# Altium schematic sheet Mainboard_ThermistorAmp.SchDoc
size A
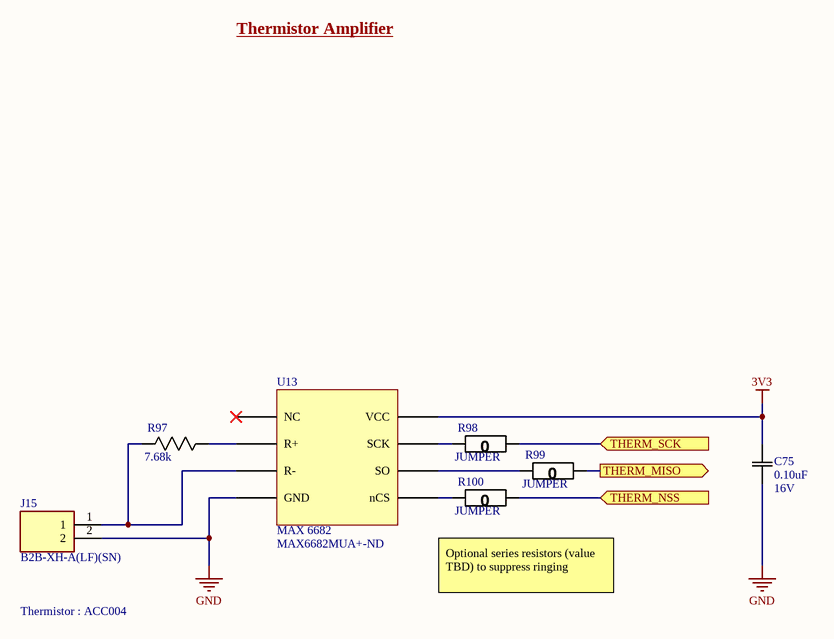
[diagram p0: Mainboard_ThermistorAmp.SchDoc]

## Parts
C75  Rating: 16V  [0805]  (hidden comment: 0.10uF)
J15  B2B-XH-A(LF)(SN)  [JST_B2B-XH-A(LF)(SN)]
R97  7.68k  [0805]
R98  JUMPER  [0805]
R99  JUMPER  [0805]
R100  JUMPER  [0805]
U13  MAX 6682  Supplier Part Number 1: MAX6682MUA+-ND  [8-MSOP]

## Ports
THERM_MISO (out), THERM_NSS (in), THERM_SCK (in)

## Nets
3V3: C75.1(C1) U13.8(VCC)
GND: C75.2(C2) J15.2 U13.4(GND)
THERM_MISO: R99.1(R1) ; port THERM_MISO
THERM_NSS: R100.1(R1) ; port THERM_NSS
THERM_SCK: R98.1(R1) ; port THERM_SCK
NetJ15_1: J15.1 R97.2(R2) U13.3(R-)
NetR97_1: R97.1(R1) U13.2(R+)
NetR98_2: R98.2(R2) U13.7(SCK)
NetR99_2: R99.2(R2) U13.6(SO)
NetR100_2: R100.2(R2) U13.5(nCS)

Not connected (* = marked no-connect by the designer): U13 1(NC)*

## Notes on the sheet
- Thermistor Amplifier
- Optional series resistors (value TBD) to suppress ringing
- Thermistor : ACC004

## Library data of the parts
C75 = CAP 0.10uF 16V: CAP CER 0.10UF 16V X5R 0603/0805; Tolerance: 10%; Package: 0603/0805; Temperature Coefficient: X5R; Operating Temperature: -55°C ~ 85°C; Value: 0.10uF
J15 = B2B-XH-A(LF)(SN): Connector Header Through Hole 2 position 0.098 _2.50mm_ / JST XH; MP: B2B-XH-A_LF__SN_; MF: JST Sales; Price: None; Package: None; Value: *; Availability: Unavailable; SnapEDA_Link: https://www.snapeda.com/parts/B2B-XH-A%28LF%29%28SN%29/JST%20Sales%20America%20Inc./view-part/492310/?ref=snap
R97 = RES 7.68k 0.15W: RES SMD 7.68K OHM 0.1% 0.15W 0805; Power (Watts): 0.125W; Tolerance: 5%; Package: 0805; Value: 7.68k
R98-R100 = RES 0 JUMPER: RES SMD 0 OHM JUMPER GENERIC 0805; Value: 0; Package: 0805
U13 = MAX 6682: MAX 6685 Thermistor - SPI converter, 8bit; Supplier 1: Digi-Key